# Altium schematic sheet [1]-PWR_12VIN.SchDoc: [1]-PWR_12VIN
size A3; DocumentNumber: 1; Revision: 01-01-2020; SheetNumber: 1; SheetTotal: 6
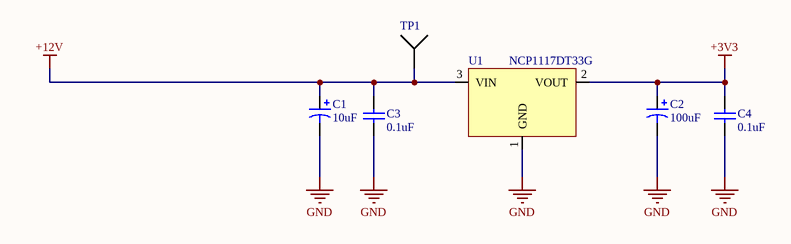
[diagram p0: [1]-PWR_12VIN.SchDoc]

## Parts
C1  10uF  [CAP_EEE_C-L]
C2  100uF  [CAPAE6553X55M]
C3  0.1uF  [CAPC1608N]
C4  0.1uF  [CAPC1608N]
TP1  TP_1_MM  [TP_1_MM]  (value not drawn)  (no BOM)
U1  NCP1117DT33G  [DPAK-L]

## Nets
+3V3: C2.1 C4.2 U1.2(VOUT)
+12V: C1.2 C3.2 TP1.1 U1.3(VIN)
GND: C1.1 C2.2 C3.1 C4.1 U1.1(GND)

## Library data of the parts
C1 = EEE-1EA100SR: CAP ALUM 10UF 20% 25V SMD; Manufacturer 1: Panasonic; Ripple Current: 28mA; Life (Hours): 2000Hour; Leakage Current: 3uA; Lead Length: 2.2mm; Supplier 1: Digi-Key; Manufacturer Part Number 1: EEE-1EA100SR; Stock 1: 6724; Pricing 1: 1=0.31, 10=0.214, 100=0.1286, 500=0.09646 (USD); Mount: PCB,Surface Mount; Case/Package: Radial; Number of Pins: 2; Contact Plating: Tin; Min Operating Temperature: -40°C; Max Operating Temperature: 85°C; Capacitance: 10uF; Tolerance: 20%; Packaging: Tape and Reel; Voltage Rating: 25V; Ripple Current (AC): 28mA; Voltage Rating (DC): 25V; Package Quantity: 1; Termination: SMD/SMT; Voltage: 25V; Diameter: 5mm; Length: 5.5mm; Height: 5.4mm; Height - Seated (Max): 0.213inch; Width: 5.3mm; Lead Pitch: 1.5mm; Radiation Hardening: No; REACH SVHC: No SVHC; Supplier Part Number 1: PCE3894CT-ND
C2 = EEE-1AA101WR: CAP ALUM 100UF 20% 10V SMD; Manufacturer 1: Panasonic ECG; Description 1: Cap Aluminum Lytic 100uF 10V 20% (5 X 5.4mm) SMD 50mA 1000h 85C Automotive T/R; Ripple Current: 50mA; Life (Hours): 1000Hour; Supplier 1: Digi-Key; Manufacturer Part Number 1: EEE-1AA101WR; Stock 1: 122621; Pricing 1: 1=0.31, 10=0.212, 100=0.1272, 500=0.0954 (USD); Mount: Surface Mount,PCB; Case/Package: Radial; Contact Plating: Tin; Min Operating Temperature: -40°C; Max Operating Temperature: 85°C; Capacitance: 100uF; Tolerance: 20%; Voltage Rating: 10V; Packaging: Tape and Reel; Package Quantity: 1; Voltage Rating (DC): 10V; Termination: SMD/SMT; Ripple Current (AC): 50mA; Diameter: 5mm; Length: 5.5mm; Height: 5.4mm; Height - Seated (Max): 0.213inch; Radiation Hardening: No; Lead Free: Lead Free; REACH SVHC: Unknown; ComponentLink1URL: https://datasheet.ciiva.com/26945/getdatasheetpartid-169213-26945071.pdf; ComponentLink1Description: https://datasheet.ciiva.com/26945/getdatasheetpartid-169213-26945071.pdf; ComponentLink2URL: https://datasheet.ciiva.com/2983/aba0000ce2-2983906.pdf; ComponentLink2Description: https://datasheet.ciiva.com/2983/aba0000ce2-2983906.pdf; ComponentLink3URL: https://datasheet.ciiva.com/24027/aba0000ce2-40801-24027541.pdf; ComponentLink3Description: https://datasheet.ciiva.com/24027/aba0000ce2-40801-24027541.pdf; ComponentLink4URL: https://datasheet.ciiva.com/30075/11aba0000ce2-30075303.pdf; ComponentLink4Description: https://datasheet.ciiva.com/30075/11aba0000ce2-30075303.pdf; ComponentLink5URL: https://datasheet.ciiva.com/16427/aba0000ce2-16427544.pdf; ComponentLink5Description: https://datasheet.ciiva.com/16427/aba0000ce2-16427544.pdf; ComponentLink6URL: https://datasheet.ciiva.com/14598/70255710-14598233.pdf; ComponentLink6Description: https://datasheet.ciiva.com/14598/70255710-14598233.pdf; ComponentLink7URL: https://datasheet.ciiva.com/14605/70255710-14605689.pdf; ComponentLink7Description: https://datasheet.ciiva.com/14605/70255710-14605689.pdf; ComponentLink8URL: https://datasheet.ciiva.com/11673/aba0000ce2-11673882.pdf; ComponentLink8Description: https://datasheet.ciiva.com/11673/aba0000ce2-11673882.pdf; Supplier Part Number 1: PCE3867CT-ND
C3 C4 = CC0603KRX7R8BB104: CAP CER 0.1UF 25V X7R 0603; Manufacturer 1: Yageo; Capacitance: 100nF; Tolerance: 10%; Supplier 1: Digi-Key; Manufacturer Part Number 1: CC0603KRX7R8BB104; Stock 1: 40000; Pricing 1: 1=0.1, 10=0.074, 100=0.0329, 500=0.02352, 1000=0.01848 (USD); Mount: Surface Mount; Case/Package: 0603; Number of Pins: 2; Case Code (Imperial): 0603; Case Code (Metric): 1608; Min Operating Temperature: -55°C; Max Operating Temperature: 125°C; Dielectric: X7R; Voltage Rating: 25V; Packaging: Tape and Reel; Package Quantity: 1; Voltage Rating (DC): 25V; Termination: SMD/SMT; Composition: Ceramic; Voltage: 25V; Length: 1.6mm; Height: 0.8mm; Width: 0.8mm; Thickness: 0.035inch; Depth: 0.8mm; Radiation Hardening: No; REACH SVHC: Unknown; Lead Free: Lead Free; Halogen Free: Halogen Free; ComponentLink1URL: https://datasheet.ciiva.com/11786/0900766b80c10176-11786120.pdf; ComponentLink1Description: https://datasheet.ciiva.com/11786/0900766b80c10176-11786120.pdf; ComponentLink2URL: https://datasheet.ciiva.com/144/mlccorderingcode-144075.pdf; ComponentLink2Description: https://datasheet.ciiva.com/144/mlccorderingcode-144075.pdf; ComponentLink3URL: https://datasheet.ciiva.com/17434/upy-gphc-x7r-6-3v-to-50v-8-17434263.pdf; ComponentLink3Description: https://datasheet.ciiva.com/17434/upy-gphc-x7r-6-3v-to-50v-8-17434263.pdf; ComponentLink4URL: https://datasheet.ciiva.com/26829/getdatasheetpartid-403577-26829431.pdf; ComponentLink4Description: https://datasheet.ciiva.com/26829/getdatasheetpartid-403577-26829431.pdf; ComponentLink5URL: https://datasheet.ciiva.com/11587/upy-gphc-x7r-6-3v-to-50v-8-11587208.pdf; ComponentLink5Description: https://datasheet.ciiva.com/11587/upy-gphc-x7r-6-3v-to-50v-8-11587208.pdf; ComponentLink6URL: https://datasheet.ciiva.com/13389/upy-gphc-x7r-6-3v-to-50v-8-13389352.pdf; ComponentLink6Description: https://datasheet.ciiva.com/13389/upy-gphc-x7r-6-3v-to-50v-8-13389352.pdf; ComponentLink7URL: https://datasheet.ciiva.com/28450/1489800-28450584.pdf; ComponentLink7Description: https://datasheet.ciiva.com/28450/1489800-28450584.pdf; ComponentLink8URL: https://datasheet.ciiva.com/144/mlccorderingcode-144073.pdf; ComponentLink8Description: https://datasheet.ciiva.com/144/mlccorderingcode-144073.pdf; ComponentLink9URL: https://datasheet.ciiva.com/144/mlccorderingcode-144074.pdf; ComponentLink9Description: https://datasheet.ciiva.com/144/mlccorderingcode-144074.pdf; ComponentLink10URL: https://datasheet.ciiva.com/7978/1489800-7978155.pdf; ComponentLink10Description: https://datasheet.ciiva.com/7978/1489800-7978155.pdf; Supplier Part Number 1: 311-1341-1-ND
U1 = IC_NCP1117DT33G: IC REG LDO 3.3V 1A DPAK; Manufacturer 1: ON Semiconductor; Dropout Voltage: 1.07V; Max Input Voltage: 20V; Number of Outputs: 1; Input Bias Current: 6mA; Polarity: Positive; Accuracy: 1%; Output Type: Fixed; Supplier 1: Digi-Key; Manufacturer Part Number 1: NCP1117DT33G; Stock 1: 3065; Pricing 1: 1=0.44, 75=0.3504, 150=0.28027, 525=0.22023, 1050=0.17017 (USD); Mount: Surface Mount; Case/Package: DPAK; Number of Pins: 3; Contact Plating: Matte,Tin; Min Operating Temperature: 0°C; Max Operating Temperature: 125°C; Output Current: 1A; Max Output Current: 1A; Output Voltage: 3.3V; Package Quantity: 75; Packaging: Rail/Tube; Nominal Output Voltage: 3.3V; Number of Regulators: 1; Min Current Limit: 1A; Quiescent Current: 6mA; Min Output Voltage: 3.3V; Output Voltage Accuracy: 1%; Length: 6.73mm; Height: 2.38mm; Width: 6.22mm; Radiation Hardening: No; REACH SVHC: No SVHC; Lead Free: Lead Free; Halogen Free: Halogen Free; Supplier Part Number 1: NCP1117DT33GOS-ND